# Altium schematic sheet lattepanda sch.SchDoc
size A4; SheetNumber: 2; SheetTotal: 2
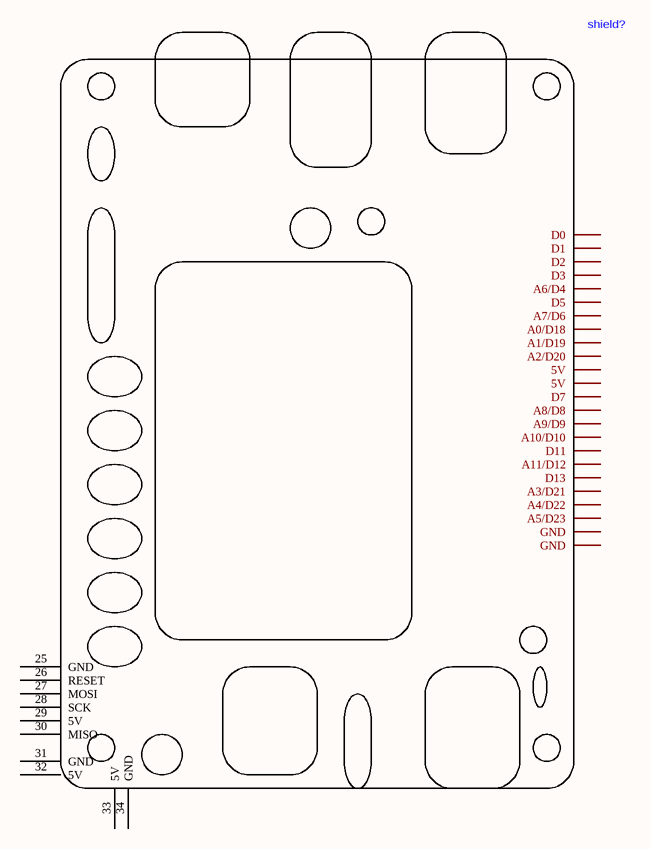
[diagram p0: lattepanda sch.SchDoc]

## Parts
shield?  (no value)  [latte panda_new]

## Nets

Not connected (* = marked no-connect by the designer): shield? 1(D7) 2(D0) 3(A8/D8) 4(D1) 5(A9/D9) 6(D2) 7(A10/D10) 8(D3) 9(D11) 10(A6/D4) 11(A11/D12) 12(D5) 13(D13) 14(A7/D6) 15(A3/D21) 16(A0/D18) 17(A4/D22) 18(A1/D19) 19(A5/D23) 20(A2/D20) 21(GND) 22(5V) 23(GND) 24(5V) 25(GND) 26(RESET) 27(MOSI) 28(SCK) 29(5V) 30(MISO) 31(GND) 32(5V) 33(5V) 34(GND)

## Library data of the parts
shield? = Lattepanda v1 4/64 by Yahya